# Altium project KitKTS.PrjPcb (part 3 of 3)

## Sheet 18-Led7.SchDoc
size A4; DocumentNumber: 19; SheetNumber: 18; SheetTotal: 26
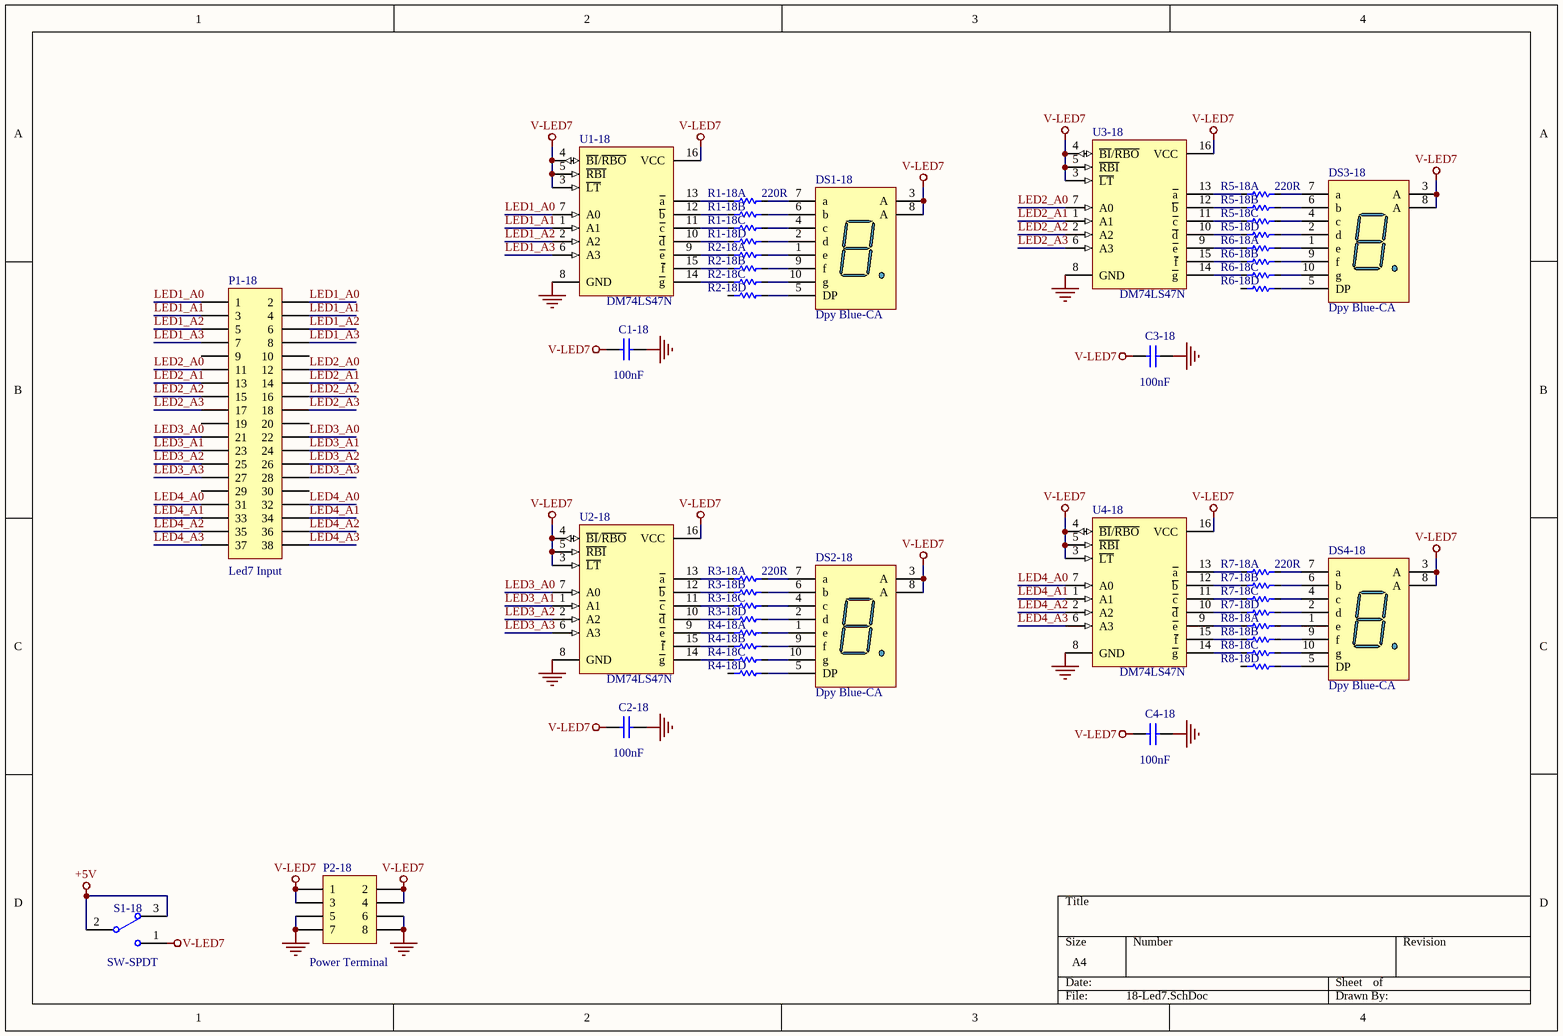
[diagram p26: 18-Led7.SchDoc]

### Parts
C1-18  value 100nF  [c-0805]  (hidden comment: 104)
C2-18  value 100nF  [c-0805]  (hidden comment: 104)
C3-18  value 100nF  [c-0805]  (hidden comment: 104)
C4-18  value 100nF  [c-0805]  (hidden comment: 104)
DS1-18  Dpy Blue-CA  [LED7-0.56inch]
DS2-18  Dpy Blue-CA  [LED7-0.56inch]
DS3-18  Dpy Blue-CA  [LED7-0.56inch]
DS4-18  Dpy Blue-CA  [LED7-0.56inch]
P1-18  value Led7 Input  [JP2.54-F-2x19A]  (hidden comment: Header 19X2)
P2-18  Publisher: Power Terminal  [JP2.54-F-2x04A]  (hidden comment: Header 4X2)
R1-18  220R  [R-Array-0603-4]  (parts A,B,C,D of 4)
R2-18  220R  [R-Array-0603-4]  (value not drawn)  (parts A,B,C,D of 4)
R3-18  220R  [R-Array-0603-4]  (parts A,B,C,D of 4)
R4-18  220R  [R-Array-0603-4]  (value not drawn)  (parts A,B,C,D of 4)
R5-18  220R  [R-Array-0603-4]  (parts A,B,C,D of 4)
R6-18  220R  [R-Array-0603-4]  (value not drawn)  (parts A,B,C,D of 4)
R7-18  220R  [R-Array-0603-4]  (parts A,B,C,D of 4)
R8-18  220R  [R-Array-0603-4]  (value not drawn)  (parts A,B,C,D of 4)
S1-18  SW-SPDT  [SW-SLIDE-2P-2W]
U1-18  DM74LS47N  [SK-DIP16-300]
U2-18  DM74LS47N  [SK-DIP16-300]
U3-18  DM74LS47N  [SK-DIP16-300]
U4-18  DM74LS47N  [SK-DIP16-300]

### Nets
+5V: S1-18.2 S1-18.3
GND: C1-18.2 C2-18.2 C3-18.2 C4-18.2 P2-18.5 P2-18.6 P2-18.7 P2-18.8 U1-18.8(GND) U2-18.8(GND) U3-18.8(GND) U4-18.8(GND)
V-LED7: C1-18.1 C2-18.1 C3-18.1 C4-18.1 DS1-18.3(A) DS1-18.8(A) DS2-18.3(A) DS2-18.8(A) DS3-18.3(A) DS3-18.8(A) DS4-18.3(A) DS4-18.8(A) P2-18.1 P2-18.2 P2-18.3 P2-18.4 S1-18.1 U1-18.3(~{LT}) U1-18.4(~{BI}/~{RBO}) U1-18.5(~{RBI}) U1-18.16(VCC) U2-18.3(~{LT}) U2-18.4(~{BI}/~{RBO}) U2-18.5(~{RBI}) U2-18.16(VCC) U3-18.3(~{LT}) U3-18.4(~{BI}/~{RBO}) U3-18.5(~{RBI}) U3-18.16(VCC) U4-18.3(~{LT}) U4-18.4(~{BI}/~{RBO}) U4-18.5(~{RBI}) U4-18.16(VCC)
LED1_A0: P1-18.1 P1-18.2 U1-18.7(A0)
LED1_A1: P1-18.3 P1-18.4 U1-18.1(A1)
LED1_A2: P1-18.5 P1-18.6 U1-18.2(A2)
LED1_A3: P1-18.7 P1-18.8 U1-18.6(A3)
LED2_A0: P1-18.11 P1-18.12 U3-18.7(A0)
LED2_A1: P1-18.13 P1-18.14 U3-18.1(A1)
LED2_A2: P1-18.15 P1-18.16 U3-18.2(A2)
LED2_A3: P1-18.17 P1-18.18 U3-18.6(A3)
LED3_A0: P1-18.21 P1-18.22 U2-18.7(A0)
LED3_A1: P1-18.23 P1-18.24 U2-18.1(A1)
LED3_A2: P1-18.25 P1-18.26 U2-18.2(A2)
LED3_A3: P1-18.27 P1-18.28 U2-18.6(A3)
LED4_A0: P1-18.31 P1-18.32 U4-18.7(A0)
LED4_A1: P1-18.33 P1-18.34 U4-18.1(A1)
LED4_A2: P1-18.35 P1-18.36 U4-18.2(A2)
LED4_A3: P1-18.37 P1-18.38 U4-18.6(A3)
NetDS1-18_1: DS1-18.1(e) R2-18.2
NetDS1-18_2: DS1-18.2(d) R1-18.8
NetDS1-18_4: DS1-18.4(c) R1-18.6
NetDS1-18_5: DS1-18.5(DP) R2-18.8
NetDS1-18_6: DS1-18.6(b) R1-18.4
NetDS1-18_7: DS1-18.7(a) R1-18.2
NetDS1-18_9: DS1-18.9(f) R2-18.4
NetDS1-18_10: DS1-18.10(g) R2-18.6
NetDS2-18_1: DS2-18.1(e) R4-18.2
NetDS2-18_2: DS2-18.2(d) R3-18.8
NetDS2-18_4: DS2-18.4(c) R3-18.6
NetDS2-18_5: DS2-18.5(DP) R4-18.8
NetDS2-18_6: DS2-18.6(b) R3-18.4
NetDS2-18_7: DS2-18.7(a) R3-18.2
NetDS2-18_9: DS2-18.9(f) R4-18.4
NetDS2-18_10: DS2-18.10(g) R4-18.6
NetDS3-18_1: DS3-18.1(e) R6-18.2
NetDS3-18_2: DS3-18.2(d) R5-18.8
NetDS3-18_4: DS3-18.4(c) R5-18.6
NetDS3-18_5: DS3-18.5(DP) R6-18.8
NetDS3-18_6: DS3-18.6(b) R5-18.4
NetDS3-18_7: DS3-18.7(a) R5-18.2
NetDS3-18_9: DS3-18.9(f) R6-18.4
NetDS3-18_10: DS3-18.10(g) R6-18.6
NetDS4-18_1: DS4-18.1(e) R8-18.2
NetDS4-18_2: DS4-18.2(d) R7-18.8
NetDS4-18_4: DS4-18.4(c) R7-18.6
NetDS4-18_5: DS4-18.5(DP) R8-18.8
NetDS4-18_6: DS4-18.6(b) R7-18.4
NetDS4-18_7: DS4-18.7(a) R7-18.2
NetDS4-18_9: DS4-18.9(f) R8-18.4
NetDS4-18_10: DS4-18.10(g) R8-18.6
NetR1-18_1: R1-18.1 U1-18.13(~{a})
NetR1-18_3: R1-18.3 U1-18.12(~{b})
NetR1-18_5: R1-18.5 U1-18.11(~{c})
NetR1-18_7: R1-18.7 U1-18.10(~{d})
NetR2-18_1: R2-18.1 U1-18.9(~{e})
NetR2-18_3: R2-18.3 U1-18.15(~{f})
NetR2-18_5: R2-18.5 U1-18.14(~{g})
NetR3-18_1: R3-18.1 U2-18.13(~{a})
NetR3-18_3: R3-18.3 U2-18.12(~{b})
NetR3-18_5: R3-18.5 U2-18.11(~{c})
NetR3-18_7: R3-18.7 U2-18.10(~{d})
NetR4-18_1: R4-18.1 U2-18.9(~{e})
NetR4-18_3: R4-18.3 U2-18.15(~{f})
NetR4-18_5: R4-18.5 U2-18.14(~{g})
NetR5-18_1: R5-18.1 U3-18.13(~{a})
NetR5-18_3: R5-18.3 U3-18.12(~{b})
NetR5-18_5: R5-18.5 U3-18.11(~{c})
NetR5-18_7: R5-18.7 U3-18.10(~{d})
NetR6-18_1: R6-18.1 U3-18.9(~{e})
NetR6-18_3: R6-18.3 U3-18.15(~{f})
NetR6-18_5: R6-18.5 U3-18.14(~{g})
NetR7-18_1: R7-18.1 U4-18.13(~{a})
NetR7-18_3: R7-18.3 U4-18.12(~{b})
NetR7-18_5: R7-18.5 U4-18.11(~{c})
NetR7-18_7: R7-18.7 U4-18.10(~{d})
NetR8-18_1: R8-18.1 U4-18.9(~{e})
NetR8-18_3: R8-18.3 U4-18.15(~{f})
NetR8-18_5: R8-18.5 U4-18.14(~{g})

Not connected (* = marked no-connect by the designer): P1-18 9 10 19 20 29 30; R2-18 7(1); R4-18 7(1); R6-18 7(1); R8-18 7(1)

### Library data of the parts
C1-18 C2-18 C3-18 C4-18 = Cap: Capacitor; Published: 8-Jun-2000; LatestRevisionDate: 17-Jul-2002; LatestRevisionNote: Re-released for DXP Platform.; PackageReference: RAD-0.3; Publisher: Altium Limited; PackageDescription: Radial Cap, Thru-Hole; 2 Leads; 0.3 in Pin Spacing
DS1-18 DS2-18 DS3-18 DS4-18 = Dpy Blue-CA: 14.2 mm General Purpose Blue 7-Segment Display: CA, RH DP, Gray Surface; MinimumIntensity: 2020 ucd; Note: IF = 10 mA; Published: 8-Jun-2000; LatestRevisionDate: 17-Dec-2003; LatestRevisionNote: Schematic revised, PCB Footprint replaced.; DatasheetVersion: 24-Sep-2002; PackageVersion: 24-Sep-2002; PackageReference: H; Publisher: Altium Limited; PackageDescription: LED, 7-Segment Display, 14.2 mm, RHD; 10 Leads; Row Space 15.24 mm; Pitch 2.54 mm; Colour: Blue; ComponentLink1Description: Manufacturer Link; ComponentLink1URL: http://www.agilent.com/
P1-18 = Header 19X2: Header, 19-Pin, Dual row; LatestRevisionDate: 17-Jul-2002; LatestRevisionNote: Re-released for DXP Platform.
P2-18 = Header 4X2: Header, 4-Pin, Dual row; LatestRevisionDate: 17-Jul-2002; LatestRevisionNote: Re-released for DXP Platform.
R1-18 R2-18 R3-18 R4-18 R5-18 R6-18 R7-18 R8-18 = R-8P4R: as R1-16 on sheet 16-BitSW; Digi-Key Part Number: Y9331TR-ND; Link: http://www.digikey.com/product-detail/en/EXB-38V331JV/Y9331TR-ND/256525
S1-18 = SW-SPDT: as S1-15 on sheet 15-DistanceSRF05; Published: 24-Mar-1999; LatestRevisionDate: 17-Dec-2003; LatestRevisionNote: Schematic revised, PCB Footprint replaced.; DatasheetVersion: 05-Dec-2000; PackageReference: TL36WW15050; Publisher: Altium Limited; PackageDescription: Switch; 4 Leads; ComponentLink1Description: Manufacturer Link; ComponentLink1URL: http://www.apem.com
U1-18 U2-18 U3-18 U4-18 = DM74LS47N: BCD to 7-Segment Decoder/Driver with Open-Collector Output; Published: 17-Jul-2002; LatestRevisionDate: 04-Mar-2005; LatestRevisionNote: Stylized 3D Model Added.; DatasheetVersion: Mar-1998; PackageVersion: 2000; PackageReference: N16E; Publisher: Altium Limited; PackageDescription: DIP, 16-Pin, Row Spacing 7.62 mm, Pitch 2.54 mm; ComponentLink1Description: Manufacturer Link; ComponentLink1URL: http://www.fairchildsemi.com/

## Nets that join several sheets
+3V3: 01-Breadboard (8 pins), 02-PowerSupply (C27-2.1 C28-2.2 U5-2.2), 16-BitSW (S10-16.2 S10-16.3)
+5V: 01-Breadboard (8 pins), 02-PowerSupply (23 pins), 03-PulseGenerator (S1-3.2 S1-3.3), 04-LogicAND (S1-4.2 S1-4.3), 05-LogicOR (S1-5.2 S1-5.3), 06-LogicNOT (S1-6.2 S1-6.3), 07-LogicXOR (S1-7.2 S1-7.3), 08-LogicNAND (S1-8.2 S1-8.3), 09-LogicNOR (S1-9.2 S1-9.3), 10-Buffer (S2-10.2 S2-10.3), 11-DFlipFlop (S5-11.2 S5-11.3), 12-JKFlipFlop (S1-12.2 S1-12.3), 13-Counter74LS90 (S1-13.2 S1-13.3), 14-Counter74LS192 (S13-14.2 S13-14.3), 15-DistanceSRF05 (S1-15.2 S1-15.3), 17-Led (S1-17.2 S1-17.3), 19-CPLD (S1-19.2 S1-19.3), 18-Led7 (S1-18.2 S1-18.3)
+12V: 01-Breadboard (8 pins), 02-PowerSupply (21 pins)
-5V: 01-Breadboard (8 pins), 02-PowerSupply (21 pins)
-12V: 01-Breadboard (8 pins), 02-PowerSupply (21 pins)
GND: 01-Breadboard (16 pins), 02-PowerSupply (54 pins), 03-PulseGenerator (36 pins), 04-LogicAND (6 pins), 04-ANDStatusLed (U1-4.8 U2-4.8), 05-LogicOR (6 pins), 05-ORStatusLed (U2-5.8 U3-5.8), 06-LogicNOT (6 pins), 06-NOTStatusLed (U2-6.8), 07-LogicXOR (6 pins), 07-XORStatusLed (U2-7.8 U3-7.8), 08-LogicNAND (6 pins), 08-NANDStatusLed (U2-8.8 U3-8.8), 09-LogicNOR (6 pins), 09-NORStatusLed (U2-9.8 U3-9.8), 10-Buffer (8 pins), 11-DFlipFlop (16 pins), 12-JKFlipFlop (8 pins), 13-Counter74LS90 (20 pins), 14-Counter74LS192 (36 pins), 15-DistanceSRF05 (9 pins), 16-BitSW (28 pins), 16-BitSWStatusLed (12 pins), 17-Led (C1-17.2 P1-17.19 P1-17.20 U1-17.9), 19-CPLD (30 pins), 18-Led7 (12 pins)
V-AND: 04-LogicAND (6 pins), 04-ANDStatusLed (14 pins)
V-NAND: 08-LogicNAND (7 pins), 08-NANDStatusLed (14 pins)
V-NOR: 09-LogicNOR (6 pins), 09-NORStatusLed (14 pins)
V-NOT: 06-LogicNOT (6 pins), 06-NOTStatusLed (7 pins)
V-OR: 05-LogicOR (6 pins), 05-ORStatusLed (14 pins)
V-SW: 16-BitSW (21 pins), 16-BitSWStatusLed (R8-16.2 R8-16.4 R8-16.6 R8-16.8)
V-XOR: 07-LogicXOR (6 pins), 07-XORStatusLed (14 pins)
VCC: 03-PulseGenerator (C1-3.1 U1-3.18), 05-LogicOR (U1-5.14), 06-LogicNOT (U1-6.14), 09-LogicNOR (U1-9.14), 12-JKFlipFlop (U1-12.4 U2-12.4)
VDD: 04-LogicAND (U3-4.14), 07-LogicXOR (U1-7.14), 11-DFlipFlop (U1-11.14 U2-11.14)
ANDI1A: 04-LogicAND (P1-4.1 P1-4.2 U3-4.1), 04-ANDStatusLed (U1-4.1)
ANDI1B: 04-LogicAND (P1-4.3 P1-4.4 U3-4.2), 04-ANDStatusLed (U1-4.2)
ANDI2A: 04-LogicAND (P1-4.7 P1-4.8 U3-4.4), 04-ANDStatusLed (U1-4.3)
ANDI2B: 04-LogicAND (P1-4.9 P1-4.10 U3-4.5), 04-ANDStatusLed (U1-4.4)
ANDI3A: 04-LogicAND (P1-4.13 P1-4.14 U3-4.9), 04-ANDStatusLed (U1-4.5)
ANDI3B: 04-LogicAND (P1-4.15 P1-4.16 U3-4.10), 04-ANDStatusLed (U1-4.6)
ANDI4A: 04-LogicAND (P1-4.19 P1-4.20 U3-4.12), 04-ANDStatusLed (U1-4.7)
ANDI4B: 04-LogicAND (P1-4.21 P1-4.22 U3-4.13), 04-ANDStatusLed (U2-4.1)
ANDY1: 04-LogicAND (P2-4.1 P2-4.2 U3-4.3), 04-ANDStatusLed (U2-4.2)
ANDY2: 04-LogicAND (P2-4.5 P2-4.6 U3-4.6), 04-ANDStatusLed (U2-4.3)
ANDY3: 04-LogicAND (P2-4.9 P2-4.10 U3-4.8), 04-ANDStatusLed (U2-4.4)
ANDY4: 04-LogicAND (P2-4.13 P2-4.14 U3-4.11), 04-ANDStatusLed (U2-4.5)
BIT0: 16-BitSW (P1-16.1 P1-16.2 R1-16.5 S3-16.16), 16-BitSWStatusLed (R5-16.2)
BIT1: 16-BitSW (P1-16.3 P1-16.4 R2-16.1 S3-16.15), 16-BitSWStatusLed (R5-16.4)
BIT2: 16-BitSW (P1-16.5 P1-16.6 R2-16.3 S3-16.14), 16-BitSWStatusLed (R5-16.6)
BIT3: 16-BitSW (P1-16.7 P1-16.8 R2-16.5 S3-16.13), 16-BitSWStatusLed (R5-16.8)
BIT4: 16-BitSW (P1-16.9 P1-16.10 R2-16.7 S3-16.12), 16-BitSWStatusLed (R6-16.2)
BIT5: 16-BitSW (P1-16.11 P1-16.12 R3-16.3 S3-16.11), 16-BitSWStatusLed (R6-16.4)
BIT6: 16-BitSW (P1-16.13 P1-16.14 R3-16.5 S3-16.10), 16-BitSWStatusLed (R6-16.6)
BIT7: 16-BitSW (P1-16.15 P1-16.16 R3-16.7 S3-16.9), 16-BitSWStatusLed (R6-16.8)
NANDI1A: 08-LogicNAND (P1-8.1 P1-8.2 U1-8.1), 08-NANDStatusLed (U2-8.1)
NANDI1B: 08-LogicNAND (P1-8.3 P1-8.4 U1-8.2), 08-NANDStatusLed (U2-8.2)
NANDI2A: 08-LogicNAND (P1-8.7 P1-8.8 U1-8.4), 08-NANDStatusLed (U2-8.3)
NANDI2B: 08-LogicNAND (P1-8.9 P1-8.10 U1-8.5), 08-NANDStatusLed (U2-8.4)
NANDI3A: 08-LogicNAND (P1-8.13 P1-8.14 U1-8.9), 08-NANDStatusLed (U2-8.5)
NANDI3B: 08-LogicNAND (P1-8.15 P1-8.16 U1-8.10), 08-NANDStatusLed (U2-8.6)
NANDI4A: 08-LogicNAND (P1-8.19 P1-8.20 U1-8.12), 08-NANDStatusLed (U2-8.7)
NANDI4B: 08-LogicNAND (P1-8.21 P1-8.22 U1-8.13), 08-NANDStatusLed (U3-8.1)
NANDY1: 08-LogicNAND (P2-8.1 P2-8.2 U1-8.3), 08-NANDStatusLed (U3-8.2)
NANDY2: 08-LogicNAND (P2-8.5 P2-8.6 U1-8.6), 08-NANDStatusLed (U3-8.3)
NANDY3: 08-LogicNAND (P2-8.9 P2-8.10 U1-8.8), 08-NANDStatusLed (U3-8.4)
NANDY4: 08-LogicNAND (P2-8.13 P2-8.14 U1-8.11), 08-NANDStatusLed (U3-8.5)
NORI1A: 09-LogicNOR (P1-9.1 P1-9.2 U1-9.2), 09-NORStatusLed (U2-9.1)
NORI1B: 09-LogicNOR (P1-9.3 P1-9.4 U1-9.3), 09-NORStatusLed (U2-9.2)
NORI2A: 09-LogicNOR (P1-9.7 P1-9.8 U1-9.5), 09-NORStatusLed (U2-9.3)
NORI2B: 09-LogicNOR (P1-9.9 P1-9.10 U1-9.6), 09-NORStatusLed (U2-9.4)
NORI3A: 09-LogicNOR (P1-9.13 P1-9.14 U1-9.8), 09-NORStatusLed (U2-9.5)
NORI3B: 09-LogicNOR (P1-9.15 P1-9.16 U1-9.9), 09-NORStatusLed (U2-9.6)
NORI4A: 09-LogicNOR (P1-9.19 P1-9.20 U1-9.11), 09-NORStatusLed (U2-9.7)
NORI4B: 09-LogicNOR (P1-9.21 P1-9.22 U1-9.12), 09-NORStatusLed (U3-9.1)
NORY1: 09-LogicNOR (P2-9.1 P2-9.2 U1-9.1), 09-NORStatusLed (U3-9.2)
NORY2: 09-LogicNOR (P2-9.5 P2-9.6 U1-9.4), 09-NORStatusLed (U3-9.3)
NORY3: 09-LogicNOR (P2-9.9 P2-9.10 U1-9.10), 09-NORStatusLed (U3-9.4)
NORY4: 09-LogicNOR (P2-9.13 P2-9.14 U1-9.13), 09-NORStatusLed (U3-9.5)
NOTI1: 06-LogicNOT (P1-6.1 P1-6.2 U1-6.1), 06-NOTStatusLed (U2-6.1)
NOTI2: 06-LogicNOT (P1-6.5 P1-6.6 U1-6.3), 06-NOTStatusLed (U2-6.2)
NOTI3: 06-LogicNOT (P1-6.9 P1-6.10 U1-6.5), 06-NOTStatusLed (U2-6.3)
NOTI4: 06-LogicNOT (P1-6.13 P1-6.14 U1-6.9), 06-NOTStatusLed (U2-6.4)
NOTI5: 06-LogicNOT (P1-6.17 P1-6.18 U1-6.11), 06-NOTStatusLed (U2-6.5)
NOTI6: 06-LogicNOT (P1-6.21 P1-6.22 U1-6.13), 06-NOTStatusLed (U2-6.6)
ORI1A: 05-LogicOR (P1-5.1 P1-5.2 U1-5.1), 05-ORStatusLed (U2-5.1)
ORI1B: 05-LogicOR (P1-5.3 P1-5.4 U1-5.2), 05-ORStatusLed (U2-5.2)
ORI2A: 05-LogicOR (P1-5.7 P1-5.8 U1-5.4), 05-ORStatusLed (U2-5.3)
ORI2B: 05-LogicOR (P1-5.9 P1-5.10 U1-5.5), 05-ORStatusLed (U2-5.4)
ORI3A: 05-LogicOR (P1-5.13 P1-5.14 U1-5.9), 05-ORStatusLed (U2-5.5)
ORI3B: 05-LogicOR (P1-5.15 P1-5.16 U1-5.10), 05-ORStatusLed (U2-5.6)
ORI4A: 05-LogicOR (P1-5.19 P1-5.20 U1-5.12), 05-ORStatusLed (U2-5.7)
ORI4B: 05-LogicOR (P1-5.21 P1-5.22 U1-5.13), 05-ORStatusLed (U3-5.1)
ORY1: 05-LogicOR (P2-5.1 P2-5.2 U1-5.3), 05-ORStatusLed (U3-5.2)
ORY2: 05-LogicOR (P2-5.5 P2-5.6 U1-5.6), 05-ORStatusLed (U3-5.3)
ORY3: 05-LogicOR (P2-5.9 P2-5.10 U1-5.8), 05-ORStatusLed (U3-5.4)
ORY4: 05-LogicOR (P2-5.13 P2-5.14 U1-5.11), 05-ORStatusLed (U3-5.5)
SW0: 16-BitSW (5 pins), 16-BitSWStatusLed (R7-16.2)
SW1: 16-BitSW (5 pins), 16-BitSWStatusLed (R7-16.4)
SW2: 16-BitSW (5 pins), 16-BitSWStatusLed (R7-16.6)
SW3: 16-BitSW (5 pins), 16-BitSWStatusLed (R7-16.8)
SW4: 16-BitSW (5 pins), 16-BitSWStatusLed (D13-16.2)
SW5: 16-BitSW (5 pins), 16-BitSWStatusLed (D14-16.2)
SW6: 16-BitSW (5 pins), 16-BitSWStatusLed (D15-16.2)
SW7: 16-BitSW (5 pins), 16-BitSWStatusLed (D16-16.2)
XORI1A: 07-LogicXOR (P1-7.1 P1-7.2 U1-7.2), 07-XORStatusLed (U2-7.1)
XORI1B: 07-LogicXOR (P1-7.3 P1-7.4 U1-7.1), 07-XORStatusLed (U2-7.2)
XORI2A: 07-LogicXOR (P1-7.7 P1-7.8 U1-7.5), 07-XORStatusLed (U2-7.3)
XORI2B: 07-LogicXOR (P1-7.9 P1-7.10 U1-7.6), 07-XORStatusLed (U2-7.4)
XORI3A: 07-LogicXOR (P1-7.13 P1-7.14 U1-7.8), 07-XORStatusLed (U2-7.5)
XORI3B: 07-LogicXOR (P1-7.15 P1-7.16 U1-7.9), 07-XORStatusLed (U2-7.6)
XORI4A: 07-LogicXOR (P1-7.19 P1-7.20 U1-7.12), 07-XORStatusLed (U2-7.7)
XORI4B: 07-LogicXOR (P1-7.21 P1-7.22 U1-7.13), 07-XORStatusLed (U3-7.1)
XORY1: 07-LogicXOR (P2-7.1 P2-7.2 U1-7.3), 07-XORStatusLed (U3-7.2)
XORY2: 07-LogicXOR (P2-7.5 P2-7.6 U1-7.4), 07-XORStatusLed (U3-7.3)
XORY3: 07-LogicXOR (P2-7.9 P2-7.10 U1-7.10), 07-XORStatusLed (U3-7.4)
XORY4: 07-LogicXOR (P2-7.13 P2-7.14 U1-7.11), 07-XORStatusLed (U3-7.5)